# EAGLE design KeyCade Cartridge (EAGLE 7.7.0)
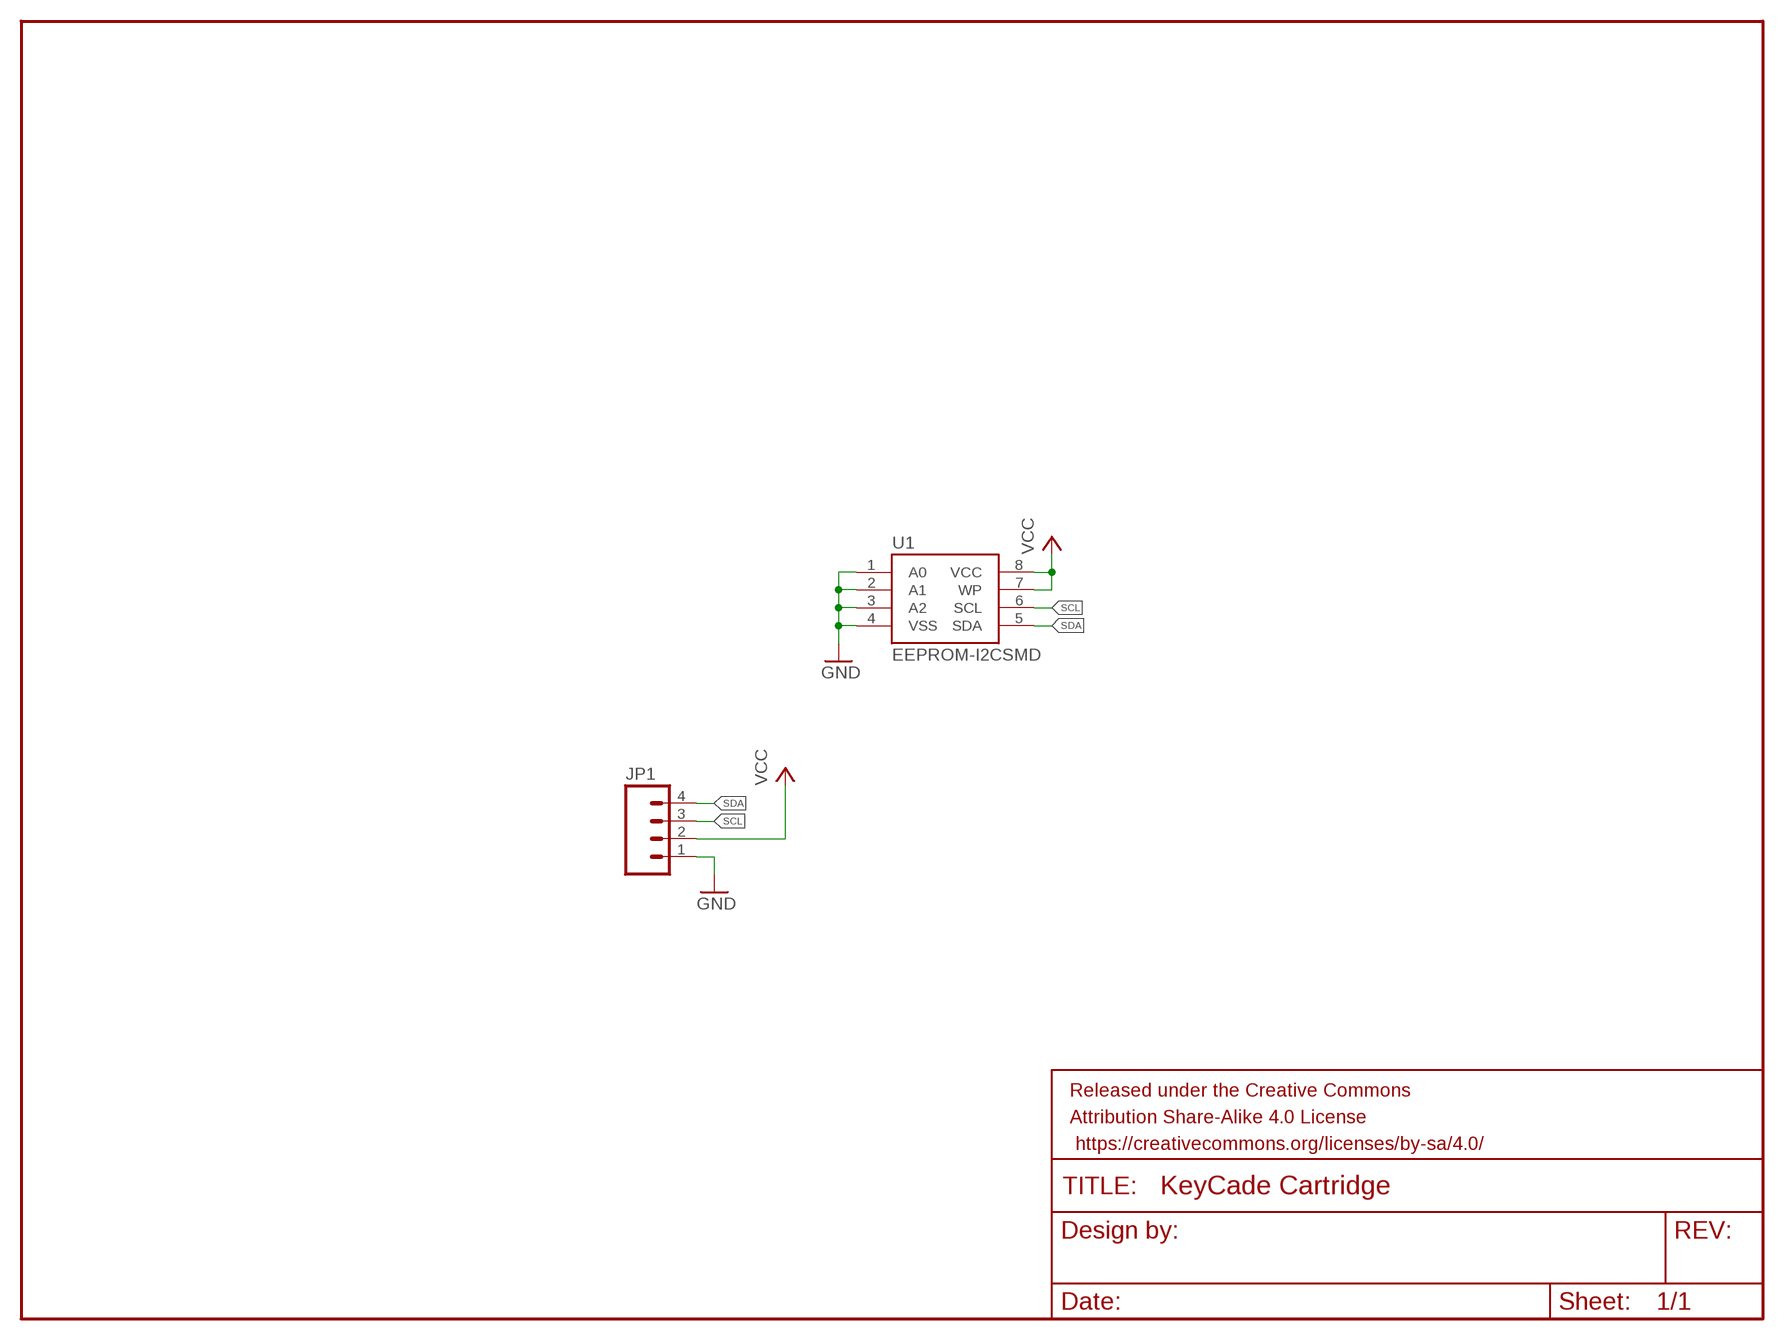
[diagram p0: schematic, sheet 1]

## Parts
FRAME1  FRAME-LETTER  [CREATIVE_COMMONS]
JP1  M04PTH  [1X04]
U1  EEPROM-I2CSMD  [SO08]

## Nets
GND: JP1.1 U1.1(A0) U1.2(A1) U1.3(A2) U1.4(VSS)
SCL: JP1.3 U1.6(SCL)
SDA: JP1.4 U1.5(SDA)
VCC: JP1.2 U1.7(WP) U1.8(VCC)

## Library data of the parts
FRAME1 = StuffLabs:FRAME-LETTER: Schematic Frame Standard 8.5x11 US Letter frame
JP1 = SparkFun-Connectors:M04: Header 4 Standard 4-pin 0.1" header. Use with straight break away headers (SKU : PRT-00116), right angle break away headers (PRT-00553), swiss pins (PRT-00743), machine pins (PRT-00117), and female headers (PRT-00115). Molex polarized connector foot print use with SKU : PRT-08231 with associated crimp pins and housings. 1MM SMD Version SKU: PRT-10208
U1 = SparkFun-DigitalIC:EEPROM-I2C: I2C EEPROM chips, 24LC256 (and others)

## Board
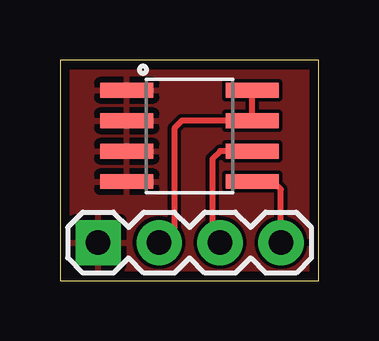
[diagram p1: board, top side]
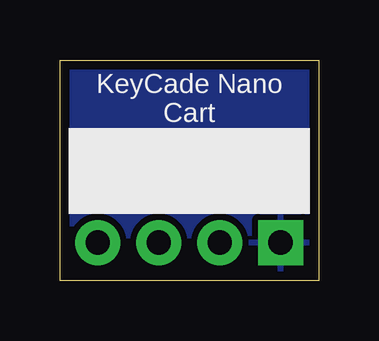
[diagram p2: board, bottom side, seen from below]

Size 10.78 x 9.2 mm. Coordinates in mm from the lower left corner, seen from the top.
Outline: 0,0 10.78,0 10.78,9.2 0,9.2 0,0
Copper layers (1*16): Top 0.035559375mm / dielectric 1.6mm / Bottom 0.035559375mm
Design rules "oshpark-2layer": minimum track width 6mil, minimum drill 10mil, track to track 6mil, track to pad 6mil, pad to pad 6mil, via to via 6mil, smd to smd 6mil, copper to edge 15mil, drill to drill 6mil, minimum pad ring 5mil, minimum via ring 5mil, stop-mask expansion 2.5mil, vias tented up to drill 0mil, thermal gap 10mil

### Footprints (pad centres in the part's own frame; a part is rotated, then mirrored left to right if it is on the bottom)
1X04 = drill 1.016 pad 1.88 square: 1 0,0 | drill 1.016 pad 1.88: 2 2.54,0; 3 5.08,0; 4 7.62,0
SO08 = smd 0.61 x 2.21: 1 -1.905,-2.616; 2 -0.635,-2.616; 3 0.635,-2.616; 4 1.905,-2.616; 5 1.905,2.616; 6 0.635,2.616; 7 -0.635,2.616; 8 -1.905,2.616

### Placement (x,y rotation side)
FRAME1  13.97,-16.51 0 top  (outside the outline)
JP1  1.59,1.59 0 top
U1  5.4,6.03 270 top

### Tracks (layer width: path | path; a pad name or v marks a point on that pad's centre or on a via)
GND
  pour Top (isolate 0.025): 0,0 10.79,0 10.79,9.21 0,9.21
  pour Bottom (isolate 0.254): 0,0 10.79,0 10.79,9.21 0,9.21
SCL
  Top 0.254: U1.6 6.67,5.4 6.35,5.08 6.35,1.91 JP1.3
SDA
  Top 0.254: JP1.4 9.21,3.81 8.89,4.13 U1.5
VCC
  Top 0.254: U1.8 U1.7 5.08,6.67 4.76,6.35 4.76,2.22 JP1.2

### Text on the board
bNames: KeyCade Nano / Cart